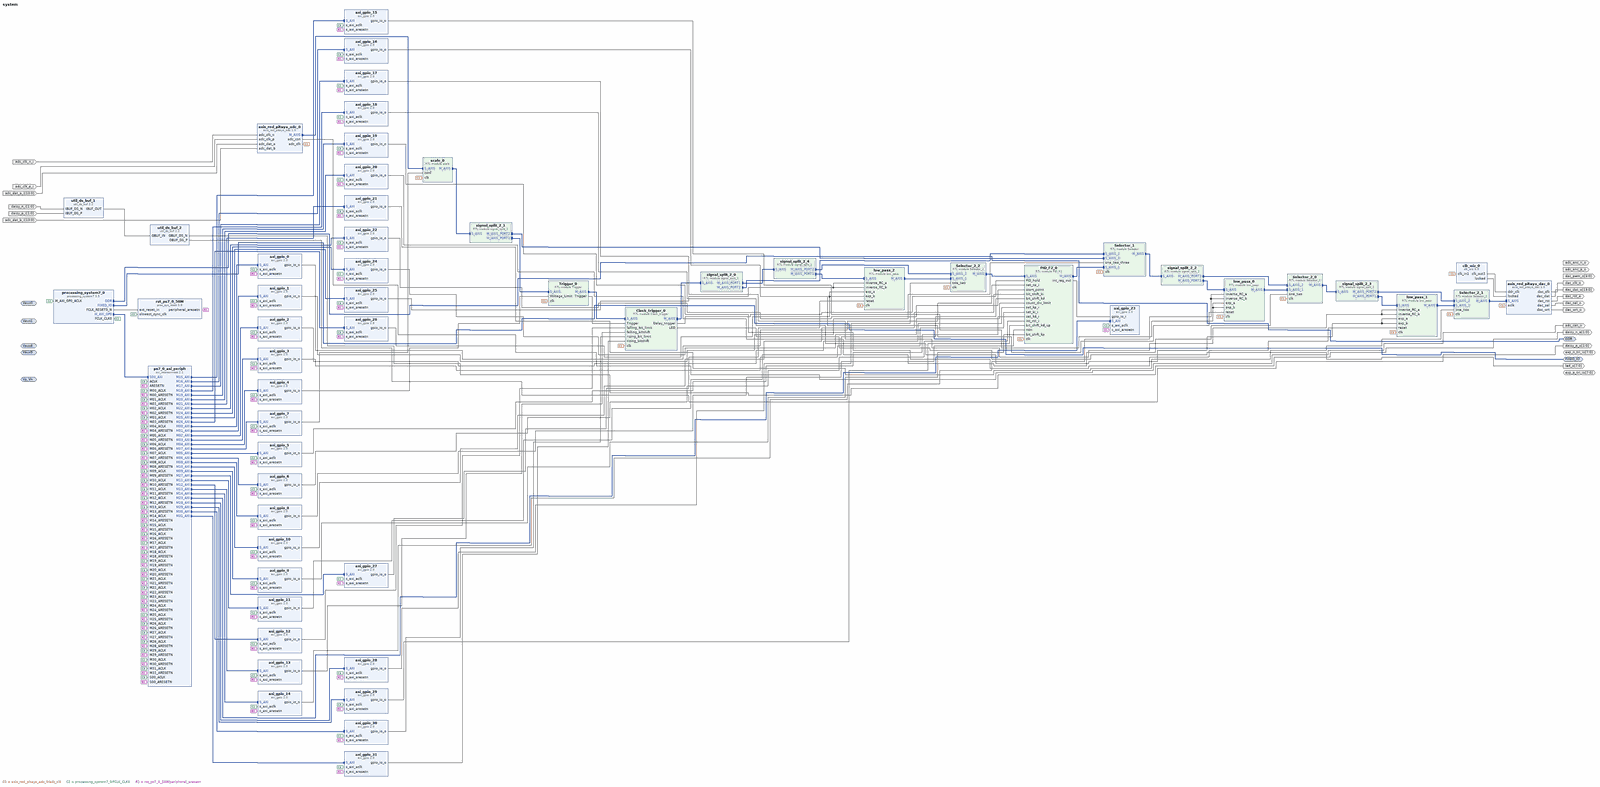
[diagram p0: block diagram of the top level, whole]
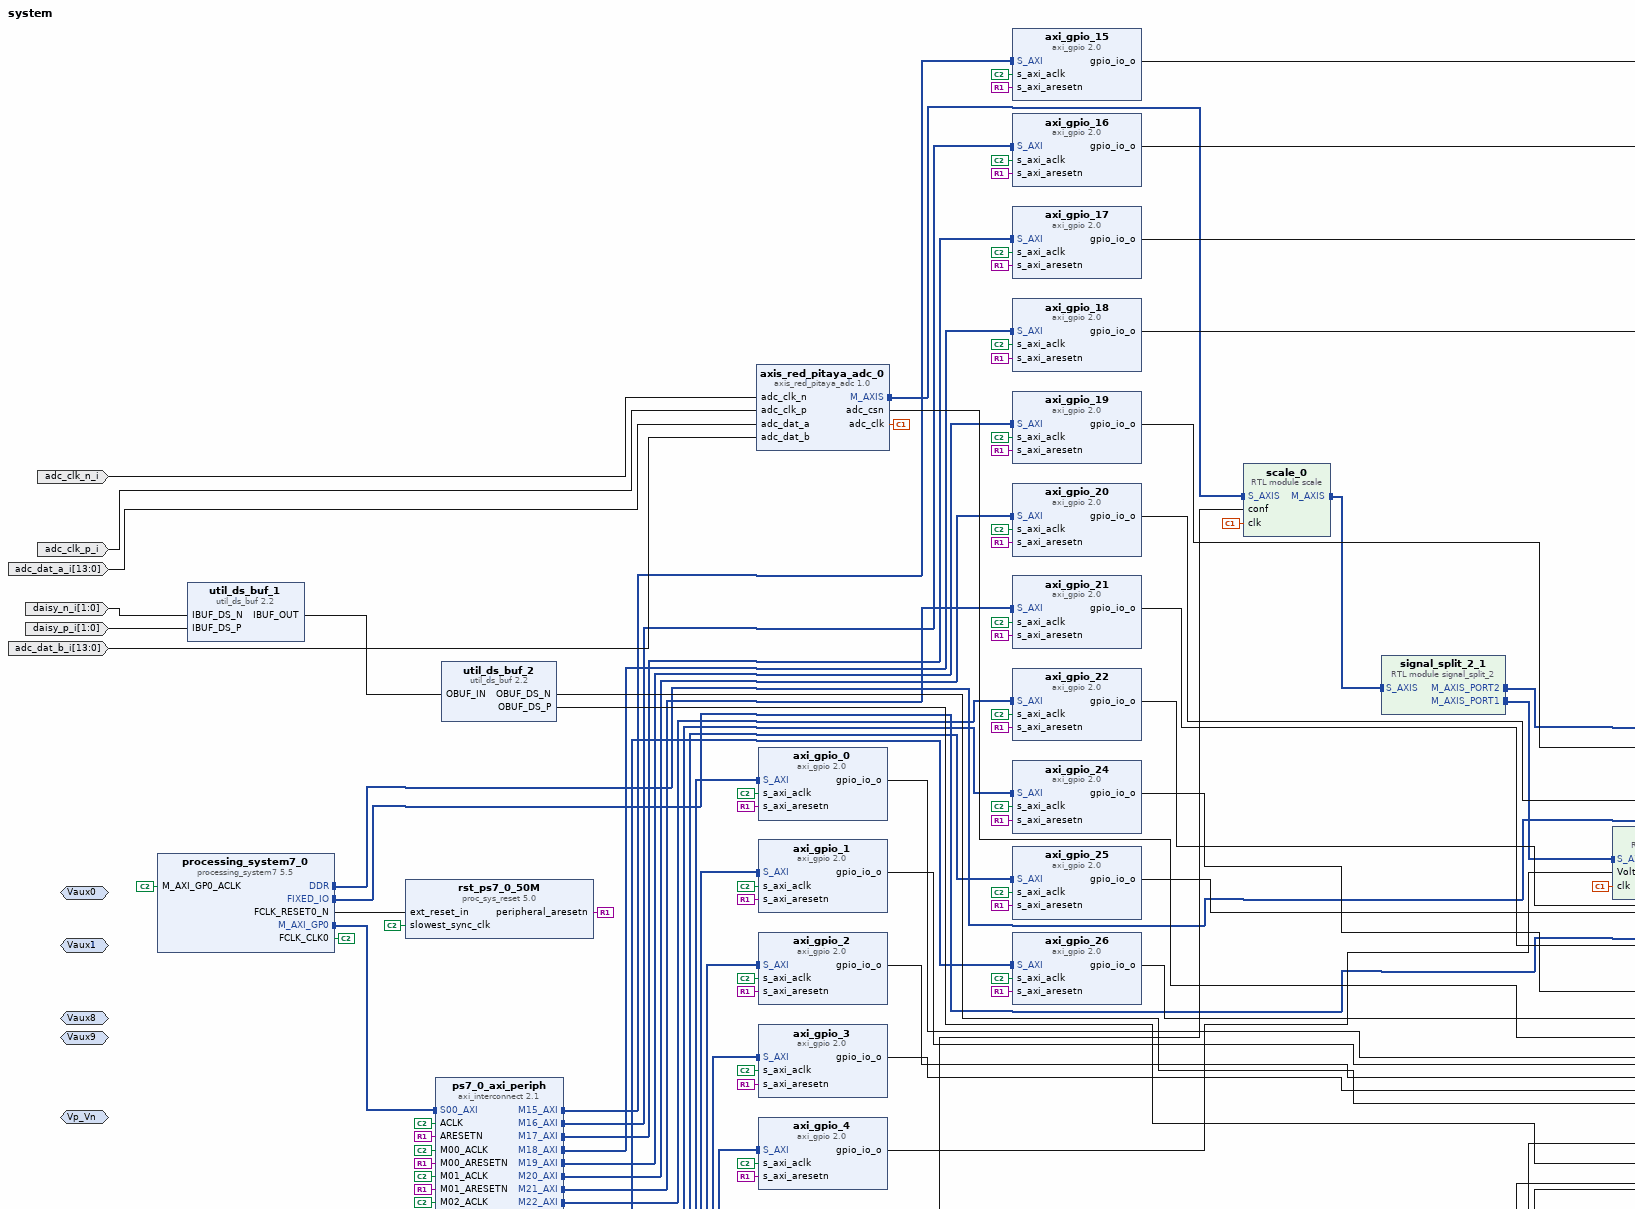
[diagram p1: block diagram of the top level, upper left part]
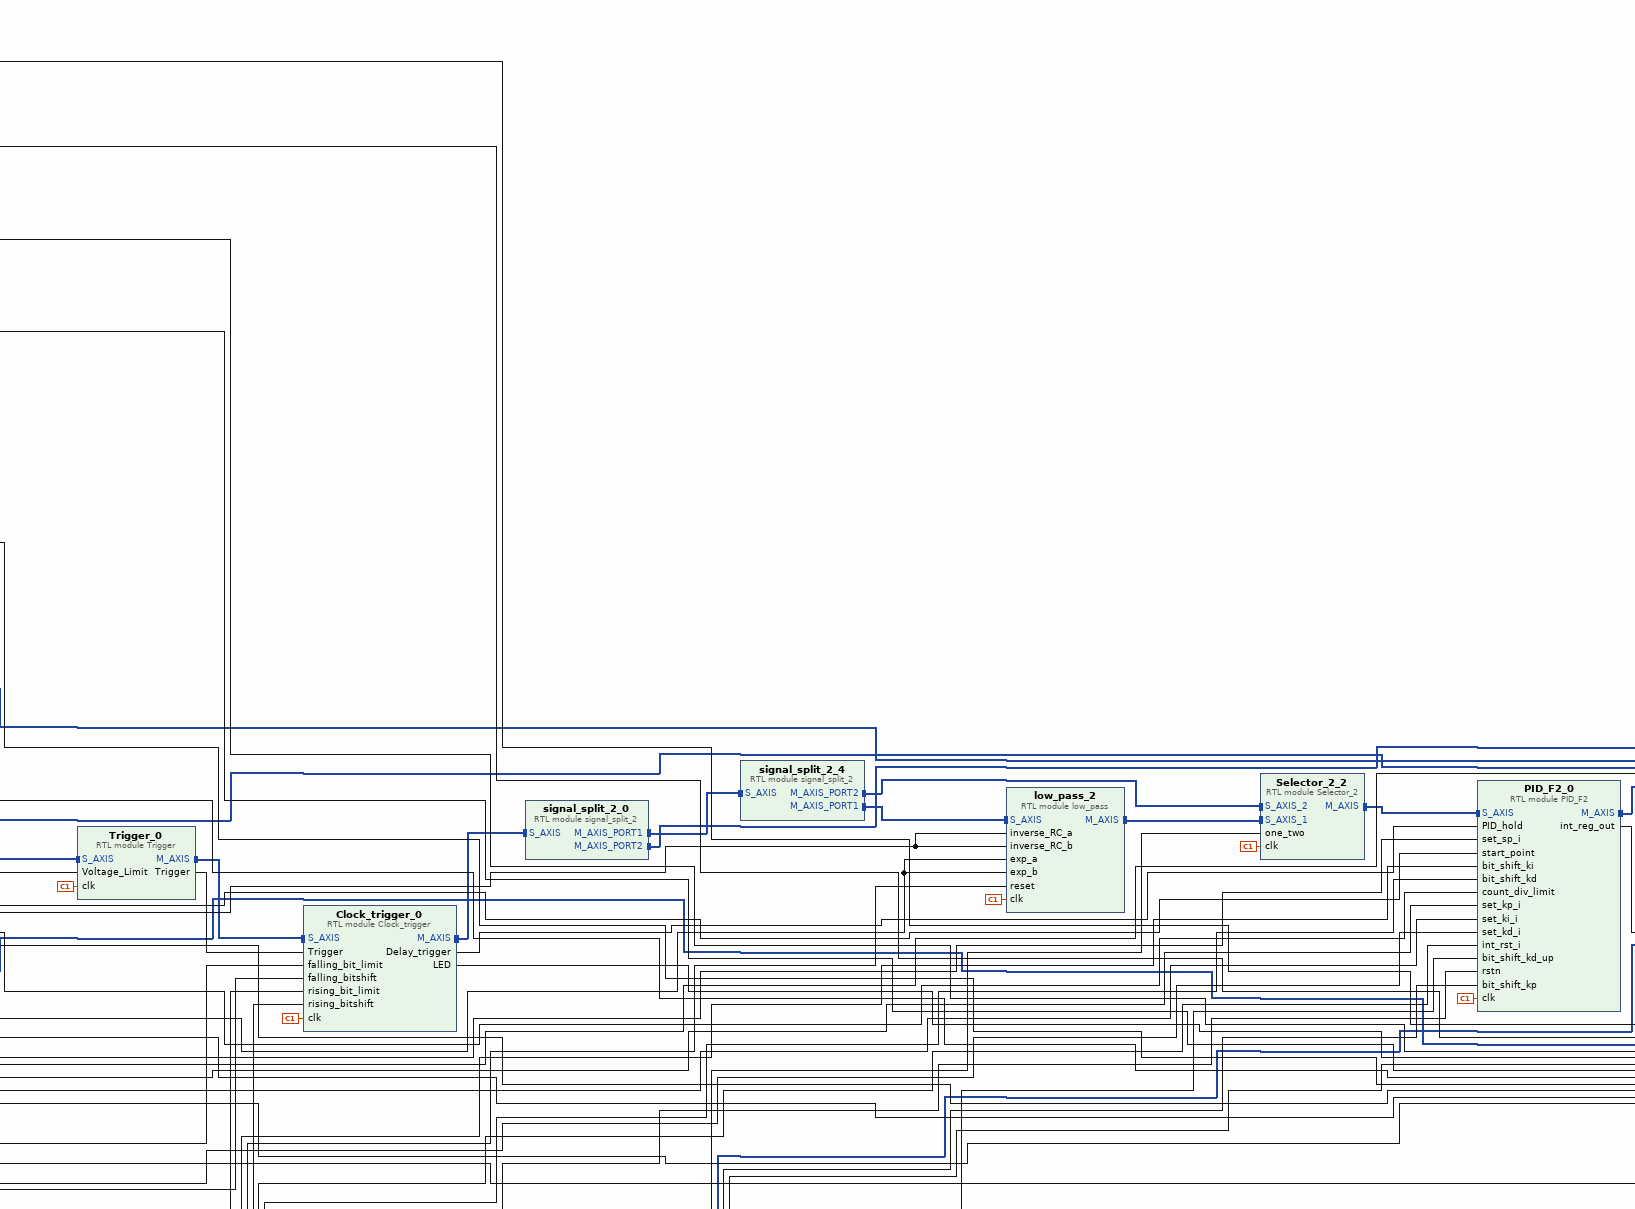
[diagram p2: block diagram of the top level, upper centre part]
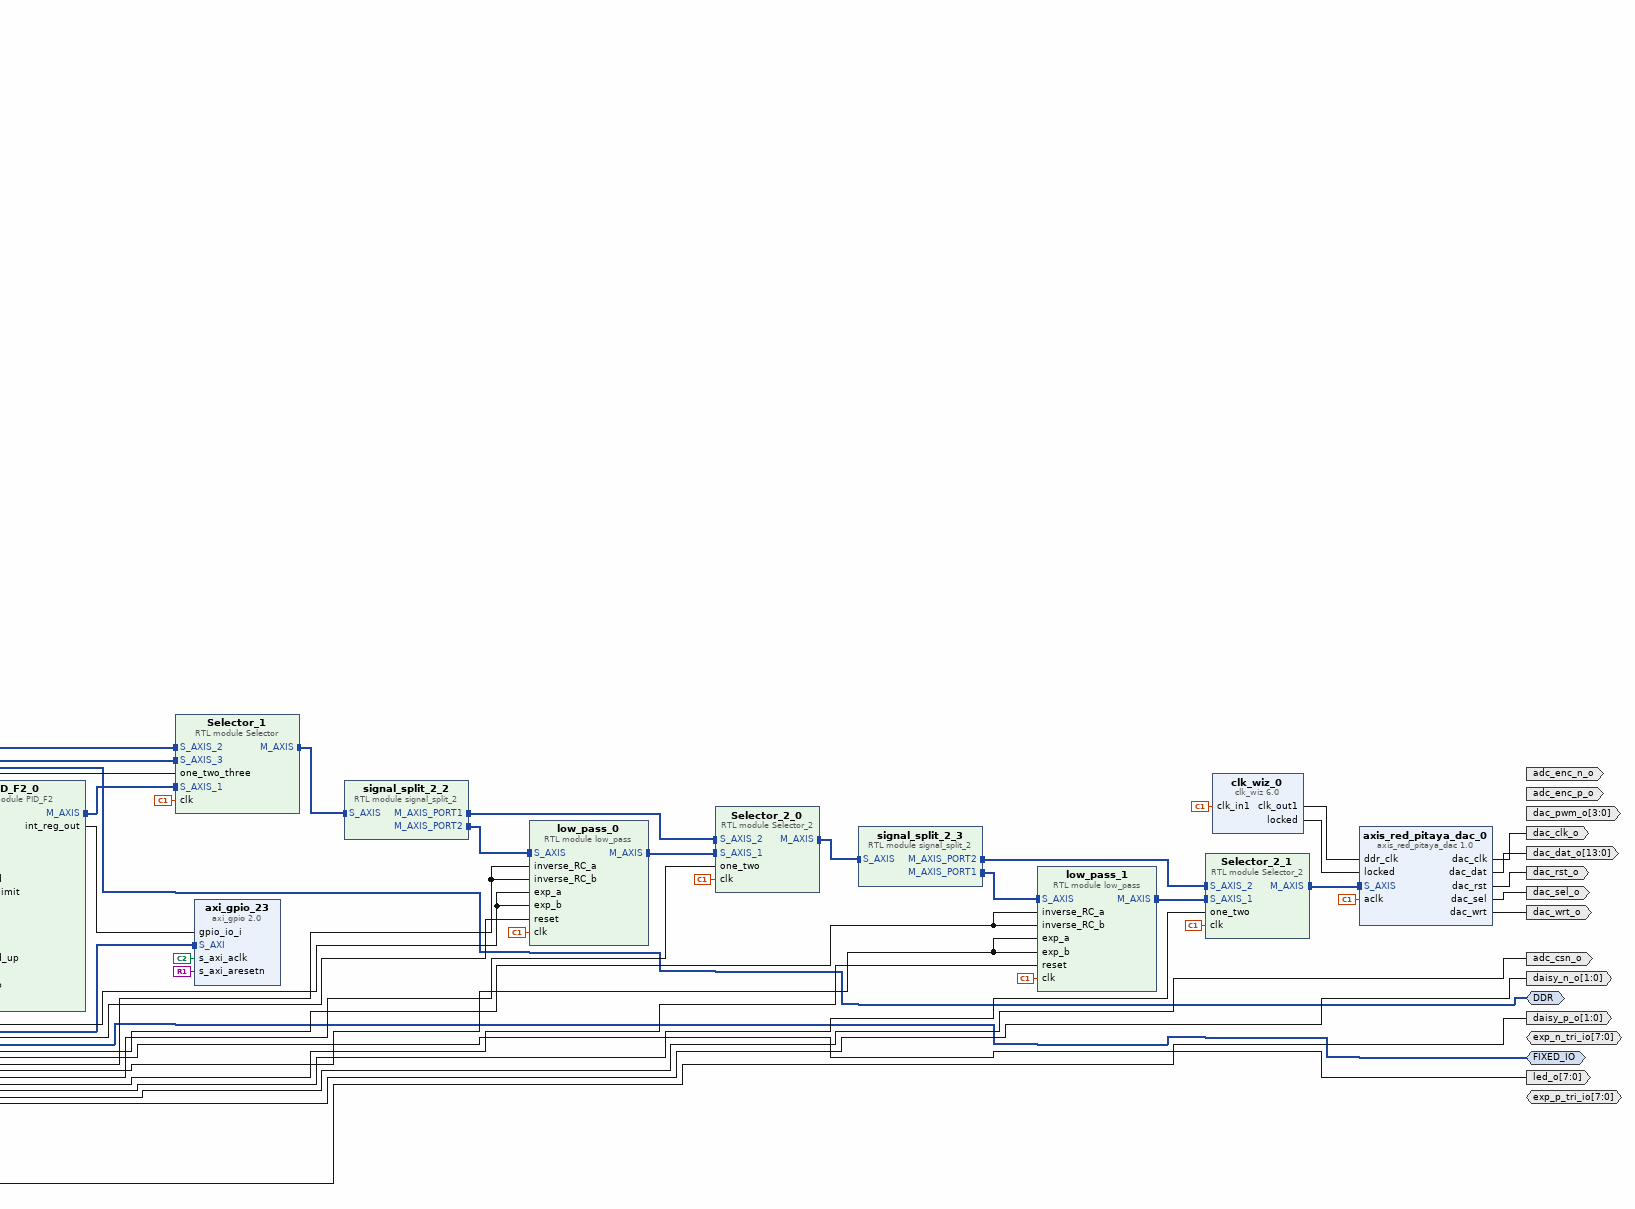
[diagram p3: block diagram of the top level, upper right part]
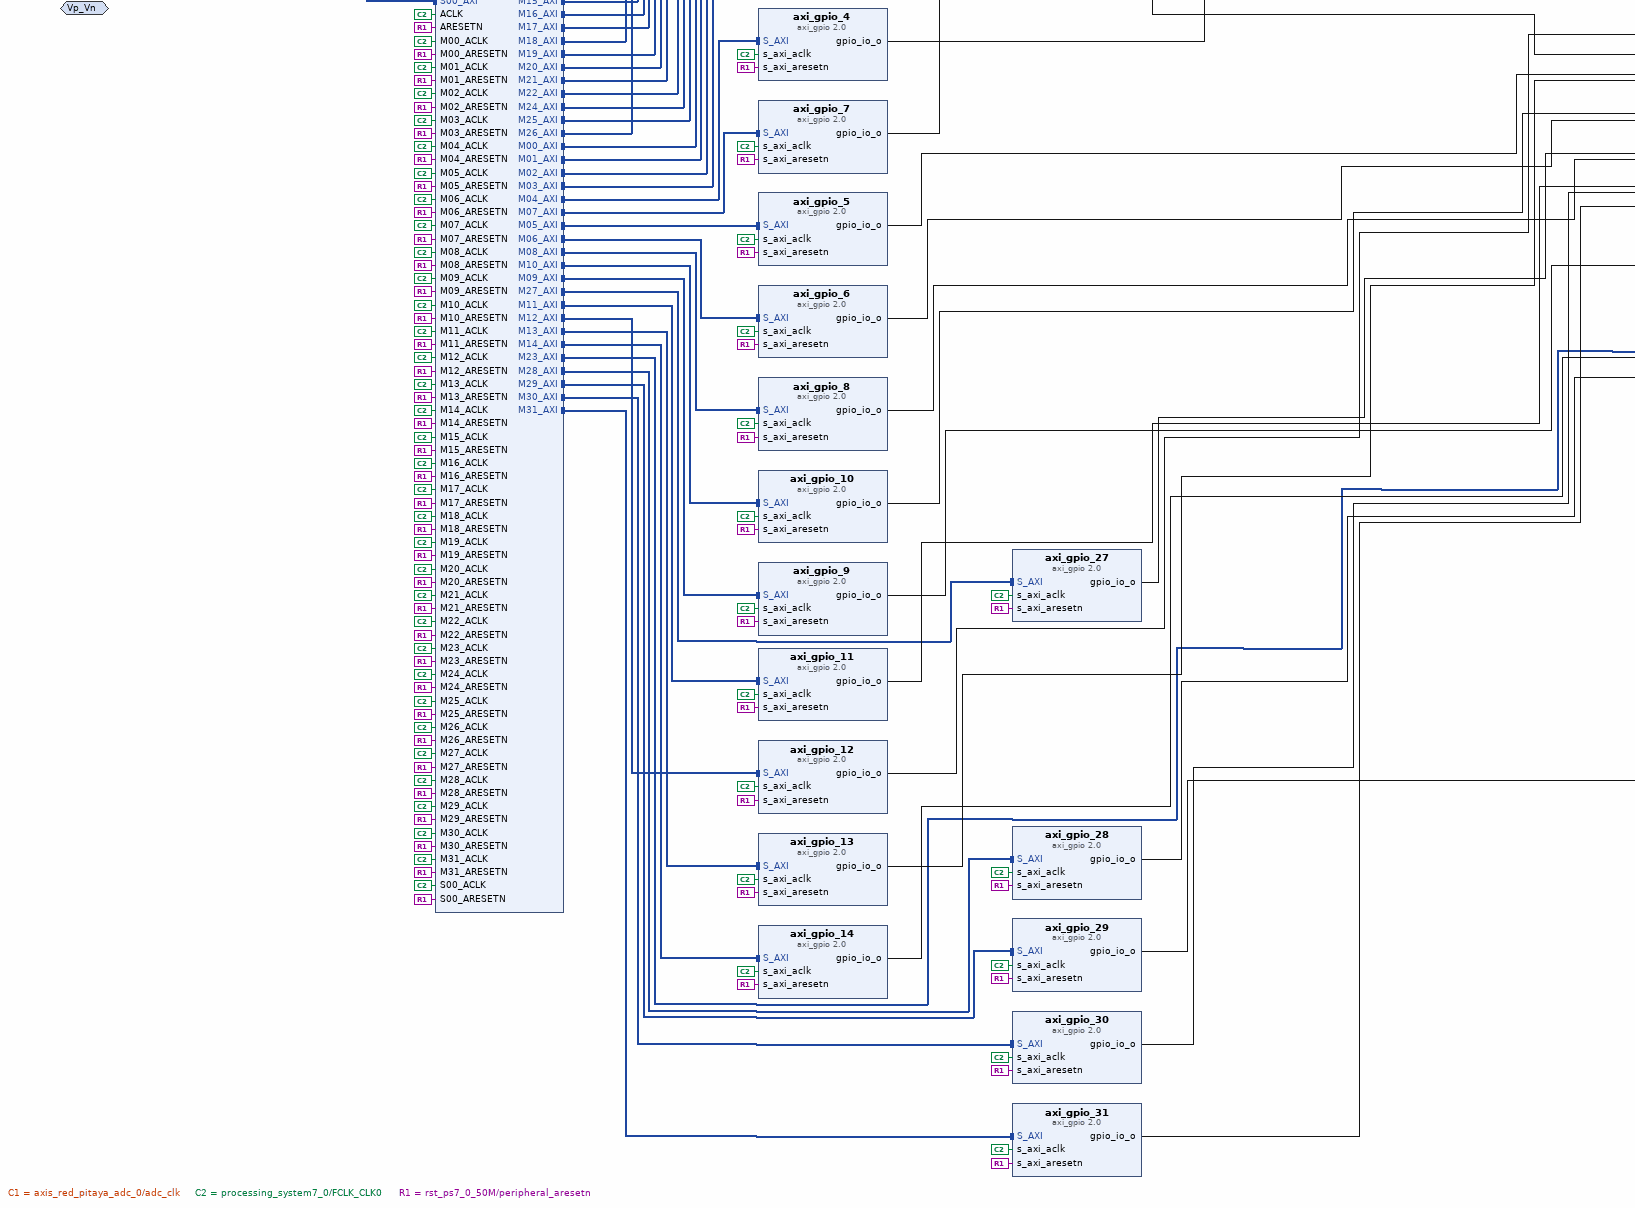
[diagram p4: block diagram of the top level, lower left part]
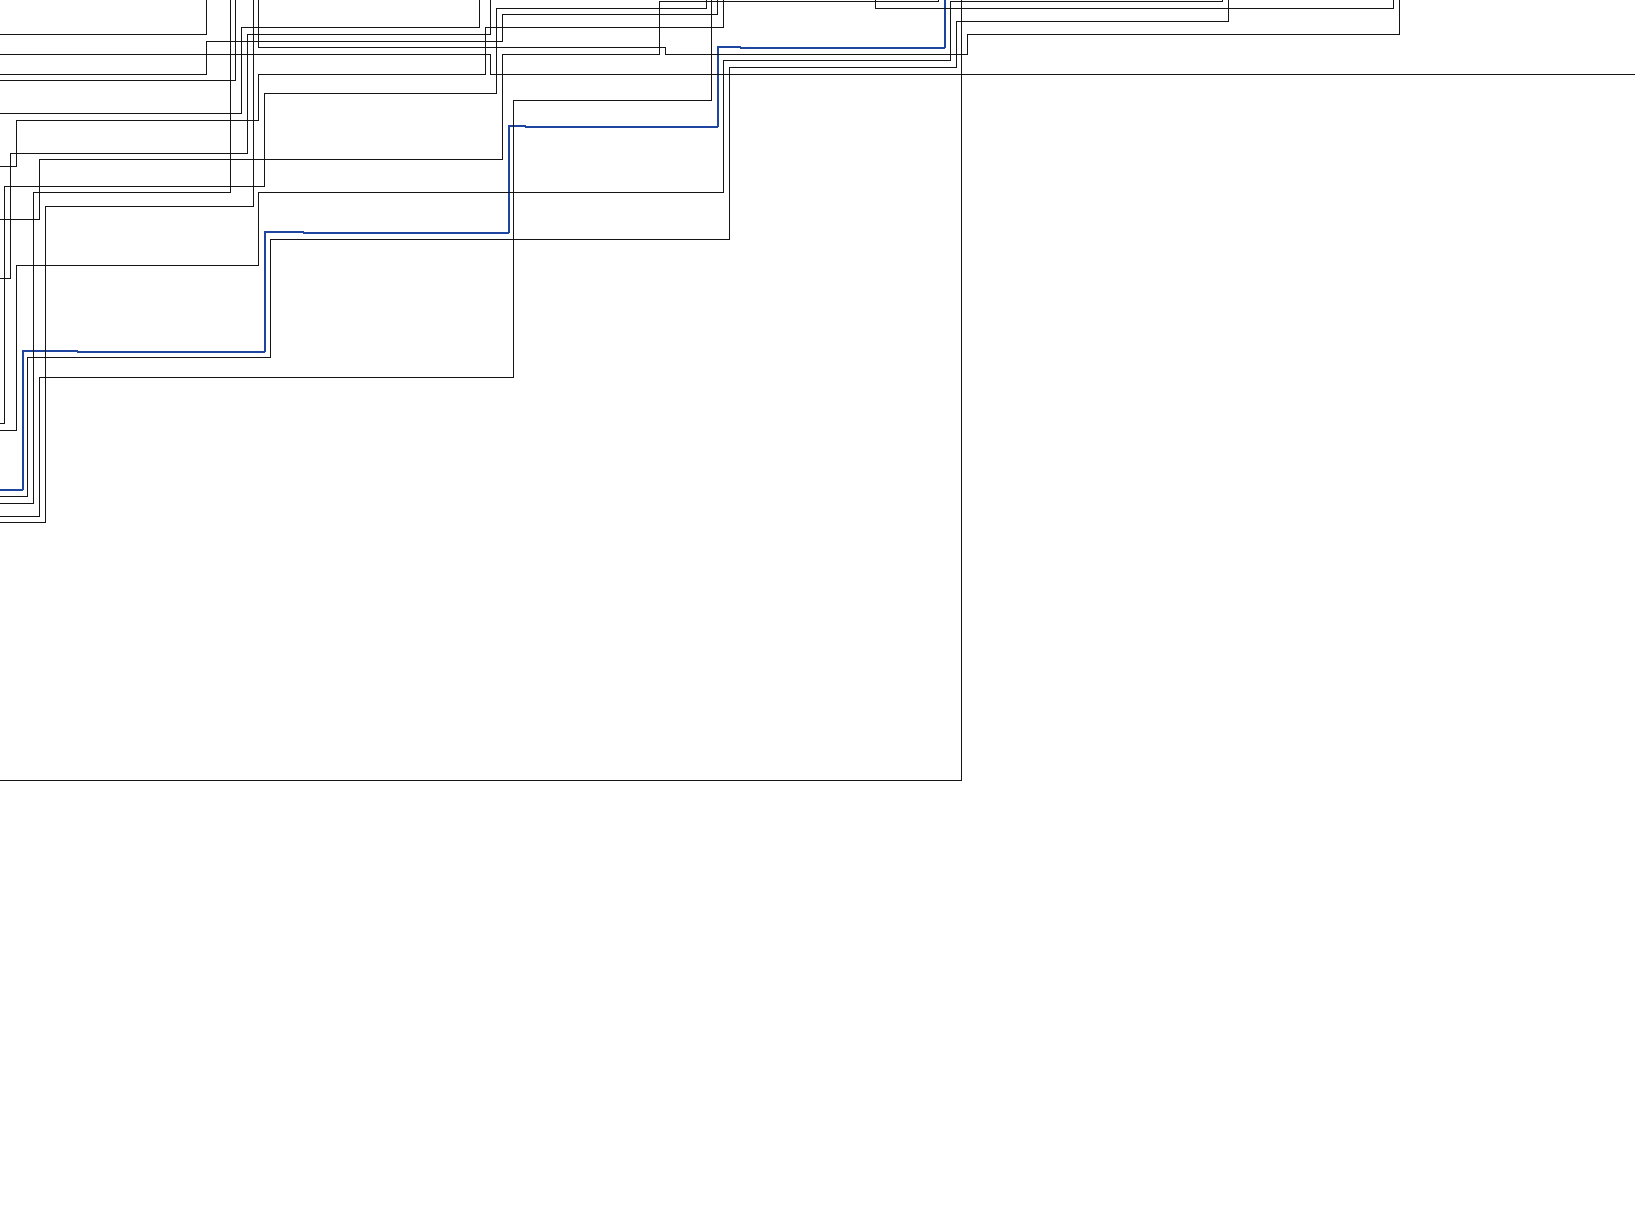
[diagram p5: block diagram of the top level, lower centre part]
# Vivado block design system, xc7z010clg400-1, Vivado 2023.2
create_bd_design system

create_bd_intf_port -mode Slave -vlnv xilinx.com:interface:diff_analog_io_rtl:1.0 Vp_Vn
create_bd_intf_port -mode Slave -vlnv xilinx.com:interface:diff_analog_io_rtl:1.0 Vaux0
create_bd_intf_port -mode Slave -vlnv xilinx.com:interface:diff_analog_io_rtl:1.0 Vaux1
create_bd_intf_port -mode Slave -vlnv xilinx.com:interface:diff_analog_io_rtl:1.0 Vaux9
create_bd_intf_port -mode Slave -vlnv xilinx.com:interface:diff_analog_io_rtl:1.0 Vaux8
create_bd_intf_port -mode Master -vlnv xilinx.com:interface:ddrx_rtl:1.0 DDR
create_bd_intf_port -mode Master -vlnv xilinx.com:display_processing_system7:fixedio_rtl:1.0 FIXED_IO
create_bd_port -dir I -from 13 -to 0 adc_dat_a_i
create_bd_port -dir I -from 13 -to 0 adc_dat_b_i
create_bd_port -dir I adc_clk_p_i
create_bd_port -dir I adc_clk_n_i
create_bd_port -dir O adc_enc_p_o
create_bd_port -dir O adc_enc_n_o
create_bd_port -dir O adc_csn_o
create_bd_port -dir O -from 13 -to 0 dac_dat_o
create_bd_port -dir O dac_clk_o
create_bd_port -dir O dac_rst_o
create_bd_port -dir O dac_sel_o
create_bd_port -dir O dac_wrt_o
create_bd_port -dir O -from 3 -to 0 dac_pwm_o
create_bd_port -dir IO -from 7 -to 0 exp_p_tri_io
create_bd_port -dir IO -from 7 -to 0 exp_n_tri_io
create_bd_port -dir O -from 1 -to 0 daisy_p_o
create_bd_port -dir O -from 1 -to 0 daisy_n_o
create_bd_port -dir I -from 1 -to 0 daisy_p_i
create_bd_port -dir I -from 1 -to 0 daisy_n_i
create_bd_port -dir O -from 7 -to 0 led_o

create_bd_cell -type ip -vlnv xilinx.com:ip:util_ds_buf:2.2 util_ds_buf_1
set_property -dict {CONFIG.C_SIZE 2} [get_bd_cells util_ds_buf_1]
create_bd_cell -type ip -vlnv xilinx.com:ip:util_ds_buf:2.2 util_ds_buf_2
set_property -dict {CONFIG.C_BUF_TYPE OBUFDS CONFIG.C_SIZE 2} [get_bd_cells util_ds_buf_2]
create_bd_cell -type ip -vlnv pavel-demin:user:axis_red_pitaya_adc:1.0 axis_red_pitaya_adc_0
create_bd_cell -type ip -vlnv pavel-demin:user:axis_red_pitaya_dac:1.0 axis_red_pitaya_dac_0
create_bd_cell -type ip -vlnv xilinx.com:ip:clk_wiz:6.0 clk_wiz_0
set_property -dict [list \
  CONFIG.CLKIN1_JITTER_PS 80.0 \
  CONFIG.CLKOUT1_JITTER 104.759 \
  CONFIG.CLKOUT1_PHASE_ERROR 96.948 \
  CONFIG.CLKOUT1_REQUESTED_OUT_FREQ 250 \
  CONFIG.MMCM_CLKFBOUT_MULT_F 8.000 \
  CONFIG.MMCM_CLKIN1_PERIOD 8.000 \
  CONFIG.MMCM_CLKOUT0_DIVIDE_F 4.000 \
  CONFIG.PRIM_IN_FREQ 125 \
  CONFIG.USE_RESET false \
] [get_bd_cells clk_wiz_0]
create_bd_cell -type module -reference signal_split_2 signal_split_2_0
create_bd_cell -type ip -vlnv xilinx.com:ip:axi_gpio:2.0 axi_gpio_1
set_property -dict {CONFIG.C_ALL_OUTPUTS 1 CONFIG.C_GPIO_WIDTH 2} [get_bd_cells axi_gpio_1]
create_bd_cell -type module -reference Trigger Trigger_0
create_bd_cell -type ip -vlnv xilinx.com:ip:axi_gpio:2.0 axi_gpio_4
set_property -dict {CONFIG.C_ALL_INPUTS 0 CONFIG.C_ALL_OUTPUTS 1 CONFIG.C_GPIO_WIDTH 14} [get_bd_cells axi_gpio_4]
create_bd_cell -type module -reference scale scale_0
create_bd_cell -type ip -vlnv xilinx.com:ip:axi_gpio:2.0 axi_gpio_7
set_property -dict {CONFIG.C_ALL_OUTPUTS 1 CONFIG.C_GPIO_WIDTH 18} [get_bd_cells axi_gpio_7]
create_bd_cell -type module -reference Selector Selector_1
create_bd_cell -type module -reference signal_split_2 signal_split_2_1
create_bd_cell -type ip -vlnv xilinx.com:ip:axi_gpio:2.0 axi_gpio_0
set_property -dict {CONFIG.C_ALL_OUTPUTS 1 CONFIG.C_GPIO_WIDTH 14} [get_bd_cells axi_gpio_0]
create_bd_cell -type ip -vlnv xilinx.com:ip:axi_gpio:2.0 axi_gpio_2
set_property -dict {CONFIG.C_ALL_OUTPUTS 1 CONFIG.C_GPIO_WIDTH 14} [get_bd_cells axi_gpio_2]
create_bd_cell -type ip -vlnv xilinx.com:ip:axi_gpio:2.0 axi_gpio_3
set_property -dict {CONFIG.C_ALL_OUTPUTS 1 CONFIG.C_GPIO_WIDTH 14} [get_bd_cells axi_gpio_3]
create_bd_cell -type ip -vlnv xilinx.com:ip:axi_gpio:2.0 axi_gpio_5
set_property -dict {CONFIG.C_ALL_OUTPUTS 1 CONFIG.C_GPIO_WIDTH 29} [get_bd_cells axi_gpio_5]
create_bd_cell -type ip -vlnv xilinx.com:ip:axi_gpio:2.0 axi_gpio_6
set_property -dict {CONFIG.C_ALL_OUTPUTS 1 CONFIG.C_GPIO_WIDTH 1} [get_bd_cells axi_gpio_6]
create_bd_cell -type ip -vlnv xilinx.com:ip:axi_gpio:2.0 axi_gpio_8
set_property -dict {CONFIG.C_ALL_OUTPUTS 1 CONFIG.C_GPIO_WIDTH 1} [get_bd_cells axi_gpio_8]
create_bd_cell -type ip -vlnv xilinx.com:ip:processing_system7:5.5 processing_system7_0
# 1 more settings of processing_system7_0 are not shown: defaults, MIO pin electricals, DDR timing, and values the tool derives
create_bd_cell -type ip -vlnv xilinx.com:ip:axi_gpio:2.0 axi_gpio_9
set_property -dict {CONFIG.C_ALL_INPUTS 0 CONFIG.C_ALL_OUTPUTS 1 CONFIG.C_GPIO_WIDTH 14} [get_bd_cells axi_gpio_9]
create_bd_cell -type ip -vlnv xilinx.com:ip:axi_gpio:2.0 axi_gpio_10
set_property -dict {CONFIG.C_ALL_INPUTS 0 CONFIG.C_ALL_OUTPUTS 1 CONFIG.C_GPIO_WIDTH 14} [get_bd_cells axi_gpio_10]
create_bd_cell -type ip -vlnv xilinx.com:ip:axi_gpio:2.0 axi_gpio_11
set_property -dict {CONFIG.C_ALL_INPUTS 0 CONFIG.C_ALL_OUTPUTS 1 CONFIG.C_GPIO_WIDTH 14} [get_bd_cells axi_gpio_11]
create_bd_cell -type ip -vlnv xilinx.com:ip:proc_sys_reset:5.0 rst_ps7_0_50M
create_bd_cell -type ip -vlnv xilinx.com:ip:axi_gpio:2.0 axi_gpio_12
set_property -dict {CONFIG.C_ALL_OUTPUTS 1 CONFIG.C_GPIO_WIDTH 32} [get_bd_cells axi_gpio_12]
create_bd_cell -type ip -vlnv xilinx.com:ip:axi_gpio:2.0 axi_gpio_13
set_property -dict {CONFIG.C_ALL_OUTPUTS 1 CONFIG.C_GPIO_WIDTH 32} [get_bd_cells axi_gpio_13]
create_bd_cell -type module -reference low_pass low_pass_0
create_bd_cell -type module -reference low_pass low_pass_1
create_bd_cell -type module -reference Selector_2 Selector_2_0
create_bd_cell -type module -reference signal_split_2 signal_split_2_2
create_bd_cell -type module -reference signal_split_2 signal_split_2_3
create_bd_cell -type module -reference Selector_2 Selector_2_1
create_bd_cell -type ip -vlnv xilinx.com:ip:axi_gpio:2.0 axi_gpio_14
set_property -dict {CONFIG.C_ALL_OUTPUTS 1 CONFIG.C_GPIO_WIDTH 14} [get_bd_cells axi_gpio_14]
create_bd_cell -type ip -vlnv xilinx.com:ip:axi_gpio:2.0 axi_gpio_15
set_property -dict {CONFIG.C_ALL_OUTPUTS 1 CONFIG.C_GPIO_WIDTH 14} [get_bd_cells axi_gpio_15]
create_bd_cell -type ip -vlnv xilinx.com:ip:axi_gpio:2.0 axi_gpio_16
set_property -dict {CONFIG.C_ALL_OUTPUTS 1 CONFIG.C_GPIO_WIDTH 1} [get_bd_cells axi_gpio_16]
create_bd_cell -type ip -vlnv xilinx.com:ip:axi_gpio:2.0 axi_gpio_17
set_property -dict {CONFIG.C_ALL_OUTPUTS 1 CONFIG.C_GPIO_WIDTH 14} [get_bd_cells axi_gpio_17]
create_bd_cell -type ip -vlnv xilinx.com:ip:axi_gpio:2.0 axi_gpio_18
set_property -dict {CONFIG.C_ALL_OUTPUTS 1 CONFIG.C_GPIO_WIDTH 14} [get_bd_cells axi_gpio_18]
create_bd_cell -type ip -vlnv xilinx.com:ip:axi_gpio:2.0 axi_gpio_19
set_property -dict {CONFIG.C_ALL_OUTPUTS 1 CONFIG.C_GPIO_WIDTH 1} [get_bd_cells axi_gpio_19]
create_bd_cell -type ip -vlnv xilinx.com:ip:axi_gpio:2.0 axi_gpio_20
set_property -dict {CONFIG.C_ALL_OUTPUTS 1 CONFIG.C_GPIO_WIDTH 1} [get_bd_cells axi_gpio_20]
create_bd_cell -type ip -vlnv xilinx.com:ip:axi_gpio:2.0 axi_gpio_21
set_property -dict {CONFIG.C_ALL_OUTPUTS 1 CONFIG.C_GPIO_WIDTH 1} [get_bd_cells axi_gpio_21]
create_bd_cell -type ip -vlnv xilinx.com:ip:axi_gpio:2.0 axi_gpio_22
set_property -dict {CONFIG.C_ALL_OUTPUTS 1 CONFIG.C_GPIO_WIDTH 14} [get_bd_cells axi_gpio_22]
create_bd_cell -type ip -vlnv xilinx.com:ip:axi_gpio:2.0 axi_gpio_23
set_property -dict {CONFIG.C_ALL_INPUTS 1 CONFIG.C_GPIO_WIDTH 32} [get_bd_cells axi_gpio_23]
create_bd_cell -type module -reference PID_F2 PID_F2_0
create_bd_cell -type ip -vlnv xilinx.com:ip:axi_gpio:2.0 axi_gpio_24
set_property -dict {CONFIG.C_ALL_OUTPUTS 1} [get_bd_cells axi_gpio_24]
create_bd_cell -type module -reference low_pass low_pass_2
create_bd_cell -type ip -vlnv xilinx.com:ip:axi_gpio:2.0 axi_gpio_25
set_property -dict {CONFIG.C_ALL_OUTPUTS 1 CONFIG.C_GPIO_WIDTH 14} [get_bd_cells axi_gpio_25]
create_bd_cell -type ip -vlnv xilinx.com:ip:axi_gpio:2.0 axi_gpio_26
set_property -dict {CONFIG.C_ALL_OUTPUTS 1 CONFIG.C_GPIO_WIDTH 14} [get_bd_cells axi_gpio_26]
create_bd_cell -type ip -vlnv xilinx.com:ip:axi_gpio:2.0 axi_gpio_27
set_property -dict {CONFIG.C_ALL_OUTPUTS 1 CONFIG.C_GPIO_WIDTH 1} [get_bd_cells axi_gpio_27]
create_bd_cell -type module -reference signal_split_2 signal_split_2_4
create_bd_cell -type module -reference Selector_2 Selector_2_2
create_bd_cell -type ip -vlnv xilinx.com:ip:axi_gpio:2.0 axi_gpio_28
set_property -dict {CONFIG.C_ALL_OUTPUTS 1 CONFIG.C_GPIO_WIDTH 1} [get_bd_cells axi_gpio_28]
create_bd_cell -type ip -vlnv xilinx.com:ip:axi_gpio:2.0 axi_gpio_29
set_property -dict {CONFIG.C_ALL_OUTPUTS 1 CONFIG.C_GPIO_WIDTH 14} [get_bd_cells axi_gpio_29]
create_bd_cell -type ip -vlnv xilinx.com:ip:axi_gpio:2.0 axi_gpio_30
set_property -dict {CONFIG.C_ALL_OUTPUTS 1} [get_bd_cells axi_gpio_30]
create_bd_cell -type ip -vlnv xilinx.com:ip:axi_gpio:2.0 axi_gpio_31
set_property -dict {CONFIG.C_ALL_OUTPUTS 1} [get_bd_cells axi_gpio_31]
create_bd_cell -type module -reference Clock_trigger Clock_trigger_0
create_bd_cell -type ip -vlnv xilinx.com:ip:axi_interconnect:2.1 ps7_0_axi_periph
set_property -dict {CONFIG.NUM_MI 32} [get_bd_cells ps7_0_axi_periph]

# ---- connections ----

connect_bd_intf_net [get_bd_intf_pins Clock_trigger_0/M_AXIS] [get_bd_intf_pins signal_split_2_0/S_AXIS]
connect_bd_intf_net [get_bd_intf_pins PID_F2_0/M_AXIS] [get_bd_intf_pins Selector_1/S_AXIS_1]
connect_bd_intf_net [get_bd_intf_pins Selector_1/M_AXIS] [get_bd_intf_pins signal_split_2_2/S_AXIS]
connect_bd_intf_net [get_bd_intf_pins Selector_2_0/M_AXIS] [get_bd_intf_pins signal_split_2_3/S_AXIS]
connect_bd_intf_net [get_bd_intf_pins Selector_2_1/M_AXIS] [get_bd_intf_pins axis_red_pitaya_dac_0/S_AXIS]
connect_bd_intf_net [get_bd_intf_pins PID_F2_0/S_AXIS] [get_bd_intf_pins Selector_2_2/M_AXIS]
connect_bd_intf_net [get_bd_intf_pins Trigger_0/M_AXIS] [get_bd_intf_pins Clock_trigger_0/S_AXIS]
connect_bd_intf_net [get_bd_intf_pins axis_red_pitaya_adc_0/M_AXIS] [get_bd_intf_pins scale_0/S_AXIS]
connect_bd_intf_net [get_bd_intf_pins low_pass_0/M_AXIS] [get_bd_intf_pins Selector_2_0/S_AXIS_1]
connect_bd_intf_net [get_bd_intf_pins low_pass_1/M_AXIS] [get_bd_intf_pins Selector_2_1/S_AXIS_1]
connect_bd_intf_net [get_bd_intf_pins low_pass_2/M_AXIS] [get_bd_intf_pins Selector_2_2/S_AXIS_1]
connect_bd_intf_net [get_bd_intf_ports DDR] [get_bd_intf_pins processing_system7_0/DDR]
connect_bd_intf_net [get_bd_intf_ports FIXED_IO] [get_bd_intf_pins processing_system7_0/FIXED_IO]
connect_bd_intf_net [get_bd_intf_pins processing_system7_0/M_AXI_GP0] [get_bd_intf_pins ps7_0_axi_periph/S00_AXI]
connect_bd_intf_net [get_bd_intf_pins ps7_0_axi_periph/M00_AXI] [get_bd_intf_pins axi_gpio_0/S_AXI]
connect_bd_intf_net [get_bd_intf_pins ps7_0_axi_periph/M01_AXI] [get_bd_intf_pins axi_gpio_1/S_AXI]
connect_bd_intf_net [get_bd_intf_pins ps7_0_axi_periph/M02_AXI] [get_bd_intf_pins axi_gpio_2/S_AXI]
connect_bd_intf_net [get_bd_intf_pins ps7_0_axi_periph/M03_AXI] [get_bd_intf_pins axi_gpio_3/S_AXI]
connect_bd_intf_net [get_bd_intf_pins ps7_0_axi_periph/M04_AXI] [get_bd_intf_pins axi_gpio_4/S_AXI]
connect_bd_intf_net [get_bd_intf_pins ps7_0_axi_periph/M05_AXI] [get_bd_intf_pins axi_gpio_5/S_AXI]
connect_bd_intf_net [get_bd_intf_pins ps7_0_axi_periph/M06_AXI] [get_bd_intf_pins axi_gpio_6/S_AXI]
connect_bd_intf_net [get_bd_intf_pins ps7_0_axi_periph/M07_AXI] [get_bd_intf_pins axi_gpio_7/S_AXI]
connect_bd_intf_net [get_bd_intf_pins ps7_0_axi_periph/M08_AXI] [get_bd_intf_pins axi_gpio_8/S_AXI]
connect_bd_intf_net [get_bd_intf_pins ps7_0_axi_periph/M09_AXI] [get_bd_intf_pins axi_gpio_9/S_AXI]
connect_bd_intf_net [get_bd_intf_pins ps7_0_axi_periph/M10_AXI] [get_bd_intf_pins axi_gpio_10/S_AXI]
connect_bd_intf_net [get_bd_intf_pins ps7_0_axi_periph/M11_AXI] [get_bd_intf_pins axi_gpio_11/S_AXI]
connect_bd_intf_net [get_bd_intf_pins ps7_0_axi_periph/M12_AXI] [get_bd_intf_pins axi_gpio_12/S_AXI]
connect_bd_intf_net [get_bd_intf_pins ps7_0_axi_periph/M13_AXI] [get_bd_intf_pins axi_gpio_13/S_AXI]
connect_bd_intf_net [get_bd_intf_pins ps7_0_axi_periph/M14_AXI] [get_bd_intf_pins axi_gpio_14/S_AXI]
connect_bd_intf_net [get_bd_intf_pins ps7_0_axi_periph/M15_AXI] [get_bd_intf_pins axi_gpio_15/S_AXI]
connect_bd_intf_net [get_bd_intf_pins ps7_0_axi_periph/M16_AXI] [get_bd_intf_pins axi_gpio_16/S_AXI]
connect_bd_intf_net [get_bd_intf_pins ps7_0_axi_periph/M17_AXI] [get_bd_intf_pins axi_gpio_17/S_AXI]
connect_bd_intf_net [get_bd_intf_pins ps7_0_axi_periph/M18_AXI] [get_bd_intf_pins axi_gpio_18/S_AXI]
connect_bd_intf_net [get_bd_intf_pins ps7_0_axi_periph/M19_AXI] [get_bd_intf_pins axi_gpio_19/S_AXI]
connect_bd_intf_net [get_bd_intf_pins ps7_0_axi_periph/M20_AXI] [get_bd_intf_pins axi_gpio_20/S_AXI]
connect_bd_intf_net [get_bd_intf_pins ps7_0_axi_periph/M21_AXI] [get_bd_intf_pins axi_gpio_21/S_AXI]
connect_bd_intf_net [get_bd_intf_pins ps7_0_axi_periph/M22_AXI] [get_bd_intf_pins axi_gpio_22/S_AXI]
connect_bd_intf_net [get_bd_intf_pins ps7_0_axi_periph/M23_AXI] [get_bd_intf_pins axi_gpio_23/S_AXI]
connect_bd_intf_net [get_bd_intf_pins ps7_0_axi_periph/M24_AXI] [get_bd_intf_pins axi_gpio_24/S_AXI]
connect_bd_intf_net [get_bd_intf_pins ps7_0_axi_periph/M25_AXI] [get_bd_intf_pins axi_gpio_25/S_AXI]
connect_bd_intf_net [get_bd_intf_pins ps7_0_axi_periph/M26_AXI] [get_bd_intf_pins axi_gpio_26/S_AXI]
connect_bd_intf_net [get_bd_intf_pins ps7_0_axi_periph/M27_AXI] [get_bd_intf_pins axi_gpio_27/S_AXI]
connect_bd_intf_net [get_bd_intf_pins ps7_0_axi_periph/M28_AXI] [get_bd_intf_pins axi_gpio_28/S_AXI]
connect_bd_intf_net [get_bd_intf_pins ps7_0_axi_periph/M29_AXI] [get_bd_intf_pins axi_gpio_29/S_AXI]
connect_bd_intf_net [get_bd_intf_pins ps7_0_axi_periph/M30_AXI] [get_bd_intf_pins axi_gpio_30/S_AXI]
connect_bd_intf_net [get_bd_intf_pins ps7_0_axi_periph/M31_AXI] [get_bd_intf_pins axi_gpio_31/S_AXI]
connect_bd_intf_net [get_bd_intf_pins signal_split_2_1/S_AXIS] [get_bd_intf_pins scale_0/M_AXIS]
connect_bd_intf_net [get_bd_intf_pins signal_split_2_0/M_AXIS_PORT1] [get_bd_intf_pins signal_split_2_4/S_AXIS]
connect_bd_intf_net [get_bd_intf_pins signal_split_2_0/M_AXIS_PORT2] [get_bd_intf_pins Selector_1/S_AXIS_2]
connect_bd_intf_net [get_bd_intf_pins signal_split_2_1/M_AXIS_PORT1] [get_bd_intf_pins Trigger_0/S_AXIS]
connect_bd_intf_net [get_bd_intf_pins signal_split_2_1/M_AXIS_PORT2] [get_bd_intf_pins Selector_1/S_AXIS_3]
connect_bd_intf_net [get_bd_intf_pins signal_split_2_2/M_AXIS_PORT1] [get_bd_intf_pins Selector_2_0/S_AXIS_2]
connect_bd_intf_net [get_bd_intf_pins signal_split_2_2/M_AXIS_PORT2] [get_bd_intf_pins low_pass_0/S_AXIS]
connect_bd_intf_net [get_bd_intf_pins signal_split_2_3/M_AXIS_PORT1] [get_bd_intf_pins low_pass_1/S_AXIS]
connect_bd_intf_net [get_bd_intf_pins signal_split_2_3/M_AXIS_PORT2] [get_bd_intf_pins Selector_2_1/S_AXIS_2]
connect_bd_intf_net [get_bd_intf_pins signal_split_2_4/M_AXIS_PORT1] [get_bd_intf_pins low_pass_2/S_AXIS]
connect_bd_intf_net [get_bd_intf_pins signal_split_2_4/M_AXIS_PORT2] [get_bd_intf_pins Selector_2_2/S_AXIS_2]
connect_bd_net [get_bd_pins Clock_trigger_0/Delay_trigger] [get_bd_pins PID_F2_0/PID_hold]
connect_bd_net [get_bd_pins Clock_trigger_0/LED] [get_bd_ports led_o]
connect_bd_net [get_bd_pins PID_F2_0/int_reg_out] [get_bd_pins axi_gpio_23/gpio_io_i]
connect_bd_net [get_bd_pins Trigger_0/Trigger] [get_bd_pins Clock_trigger_0/Trigger]
connect_bd_net [get_bd_ports adc_clk_n_i] [get_bd_pins axis_red_pitaya_adc_0/adc_clk_n]
connect_bd_net [get_bd_ports adc_clk_p_i] [get_bd_pins axis_red_pitaya_adc_0/adc_clk_p]
connect_bd_net [get_bd_ports adc_dat_a_i] [get_bd_pins axis_red_pitaya_adc_0/adc_dat_a]
connect_bd_net [get_bd_ports adc_dat_b_i] [get_bd_pins axis_red_pitaya_adc_0/adc_dat_b]
connect_bd_net [get_bd_pins axi_gpio_0/gpio_io_o] [get_bd_pins PID_F2_0/set_sp_i]
connect_bd_net [get_bd_pins axi_gpio_10/gpio_io_o] [get_bd_pins PID_F2_0/bit_shift_ki]
connect_bd_net [get_bd_pins axi_gpio_11/gpio_io_o] [get_bd_pins PID_F2_0/bit_shift_kd]
connect_bd_net [get_bd_pins axi_gpio_12/gpio_io_o] [get_bd_pins Clock_trigger_0/falling_bit_limit]
connect_bd_net [get_bd_pins axi_gpio_13/gpio_io_o] [get_bd_pins Clock_trigger_0/falling_bitshift]
connect_bd_net [get_bd_pins axi_gpio_14/gpio_io_o] [get_bd_pins low_pass_0/inverse_RC_a] [get_bd_pins low_pass_0/inverse_RC_b]
connect_bd_net [get_bd_pins axi_gpio_15/gpio_io_o] [get_bd_pins low_pass_0/exp_a] [get_bd_pins low_pass_0/exp_b]
connect_bd_net [get_bd_pins axi_gpio_16/gpio_io_o] [get_bd_pins low_pass_0/reset]
connect_bd_net [get_bd_pins axi_gpio_17/gpio_io_o] [get_bd_pins low_pass_1/inverse_RC_a] [get_bd_pins low_pass_1/inverse_RC_b]
connect_bd_net [get_bd_pins axi_gpio_18/gpio_io_o] [get_bd_pins low_pass_1/exp_a] [get_bd_pins low_pass_1/exp_b]
connect_bd_net [get_bd_pins axi_gpio_19/gpio_io_o] [get_bd_pins low_pass_1/reset]
connect_bd_net [get_bd_pins axi_gpio_1/gpio_io_o] [get_bd_pins Selector_1/one_two_three]
connect_bd_net [get_bd_pins axi_gpio_20/gpio_io_o] [get_bd_pins Selector_2_0/one_two]
connect_bd_net [get_bd_pins axi_gpio_21/gpio_io_o] [get_bd_pins Selector_2_1/one_two]
connect_bd_net [get_bd_pins axi_gpio_22/gpio_io_o] [get_bd_pins PID_F2_0/start_point]
connect_bd_net [get_bd_pins axi_gpio_24/gpio_io_o] [get_bd_pins PID_F2_0/count_div_limit]
connect_bd_net [get_bd_pins axi_gpio_25/gpio_io_o] [get_bd_pins low_pass_2/inverse_RC_a] [get_bd_pins low_pass_2/inverse_RC_b]
connect_bd_net [get_bd_pins axi_gpio_26/gpio_io_o] [get_bd_pins low_pass_2/exp_a] [get_bd_pins low_pass_2/exp_b]
connect_bd_net [get_bd_pins axi_gpio_27/gpio_io_o] [get_bd_pins low_pass_2/reset]
connect_bd_net [get_bd_pins axi_gpio_28/gpio_io_o] [get_bd_pins Selector_2_2/one_two]
connect_bd_net [get_bd_pins axi_gpio_29/gpio_io_o] [get_bd_pins PID_F2_0/bit_shift_kd_up]
connect_bd_net [get_bd_pins axi_gpio_2/gpio_io_o] [get_bd_pins PID_F2_0/set_kp_i]
connect_bd_net [get_bd_pins axi_gpio_30/gpio_io_o] [get_bd_pins Clock_trigger_0/rising_bit_limit]
connect_bd_net [get_bd_pins axi_gpio_31/gpio_io_o] [get_bd_pins Clock_trigger_0/rising_bitshift]
connect_bd_net [get_bd_pins axi_gpio_3/gpio_io_o] [get_bd_pins PID_F2_0/set_ki_i]
connect_bd_net [get_bd_pins axi_gpio_4/gpio_io_o] [get_bd_pins Trigger_0/Voltage_Limit]
connect_bd_net [get_bd_pins axi_gpio_5/gpio_io_o] [get_bd_pins PID_F2_0/set_kd_i]
connect_bd_net [get_bd_pins axi_gpio_6/gpio_io_o] [get_bd_pins PID_F2_0/int_rst_i]
connect_bd_net [get_bd_pins axi_gpio_7/gpio_io_o] [get_bd_pins scale_0/conf]
connect_bd_net [get_bd_pins axi_gpio_8/gpio_io_o] [get_bd_pins PID_F2_0/rstn]
connect_bd_net [get_bd_pins axi_gpio_9/gpio_io_o] [get_bd_pins PID_F2_0/bit_shift_kp]
connect_bd_net [get_bd_pins axis_red_pitaya_adc_0/adc_clk] \
  [get_bd_pins axis_red_pitaya_dac_0/aclk] [get_bd_pins clk_wiz_0/clk_in1] [get_bd_pins scale_0/clk] \
  [get_bd_pins Selector_1/clk] [get_bd_pins Selector_2_0/clk] [get_bd_pins Selector_2_1/clk] [get_bd_pins low_pass_0/clk] \
  [get_bd_pins low_pass_1/clk] [get_bd_pins low_pass_2/clk] [get_bd_pins Selector_2_2/clk] [get_bd_pins Clock_trigger_0/clk] \
  [get_bd_pins Trigger_0/clk] [get_bd_pins PID_F2_0/clk]
connect_bd_net [get_bd_pins axis_red_pitaya_adc_0/adc_csn] [get_bd_ports adc_csn_o]
connect_bd_net [get_bd_pins axis_red_pitaya_dac_0/dac_clk] [get_bd_ports dac_clk_o]
connect_bd_net [get_bd_pins axis_red_pitaya_dac_0/dac_dat] [get_bd_ports dac_dat_o]
connect_bd_net [get_bd_pins axis_red_pitaya_dac_0/dac_rst] [get_bd_ports dac_rst_o]
connect_bd_net [get_bd_pins axis_red_pitaya_dac_0/dac_sel] [get_bd_ports dac_sel_o]
connect_bd_net [get_bd_pins axis_red_pitaya_dac_0/dac_wrt] [get_bd_ports dac_wrt_o]
connect_bd_net [get_bd_pins clk_wiz_0/clk_out1] [get_bd_pins axis_red_pitaya_dac_0/ddr_clk]
connect_bd_net [get_bd_pins clk_wiz_0/locked] [get_bd_pins axis_red_pitaya_dac_0/locked]
connect_bd_net [get_bd_ports daisy_n_i] [get_bd_pins util_ds_buf_1/IBUF_DS_N]
connect_bd_net [get_bd_ports daisy_p_i] [get_bd_pins util_ds_buf_1/IBUF_DS_P]
connect_bd_net [get_bd_pins processing_system7_0/FCLK_CLK0] \
  [get_bd_pins processing_system7_0/M_AXI_GP0_ACLK] [get_bd_pins axi_gpio_0/s_axi_aclk] [get_bd_pins axi_gpio_1/s_axi_aclk] \
  [get_bd_pins axi_gpio_2/s_axi_aclk] [get_bd_pins axi_gpio_3/s_axi_aclk] [get_bd_pins axi_gpio_4/s_axi_aclk] \
  [get_bd_pins axi_gpio_5/s_axi_aclk] [get_bd_pins axi_gpio_6/s_axi_aclk] [get_bd_pins axi_gpio_7/s_axi_aclk] \
  [get_bd_pins axi_gpio_8/s_axi_aclk] [get_bd_pins axi_gpio_9/s_axi_aclk] [get_bd_pins axi_gpio_10/s_axi_aclk] \
  [get_bd_pins axi_gpio_11/s_axi_aclk] [get_bd_pins rst_ps7_0_50M/slowest_sync_clk] [get_bd_pins axi_gpio_12/s_axi_aclk] \
  [get_bd_pins axi_gpio_13/s_axi_aclk] [get_bd_pins axi_gpio_14/s_axi_aclk] [get_bd_pins axi_gpio_15/s_axi_aclk] \
  [get_bd_pins axi_gpio_16/s_axi_aclk] [get_bd_pins axi_gpio_17/s_axi_aclk] [get_bd_pins axi_gpio_18/s_axi_aclk] \
  [get_bd_pins axi_gpio_19/s_axi_aclk] [get_bd_pins axi_gpio_20/s_axi_aclk] [get_bd_pins axi_gpio_21/s_axi_aclk] \
  [get_bd_pins axi_gpio_22/s_axi_aclk] [get_bd_pins axi_gpio_23/s_axi_aclk] [get_bd_pins axi_gpio_24/s_axi_aclk] \
  [get_bd_pins axi_gpio_25/s_axi_aclk] [get_bd_pins axi_gpio_26/s_axi_aclk] [get_bd_pins axi_gpio_27/s_axi_aclk] \
  [get_bd_pins axi_gpio_28/s_axi_aclk] [get_bd_pins axi_gpio_29/s_axi_aclk] [get_bd_pins axi_gpio_30/s_axi_aclk] \
  [get_bd_pins axi_gpio_31/s_axi_aclk] [get_bd_pins ps7_0_axi_periph/ACLK] [get_bd_pins ps7_0_axi_periph/S00_ACLK] \
  [get_bd_pins ps7_0_axi_periph/M00_ACLK] [get_bd_pins ps7_0_axi_periph/M01_ACLK] [get_bd_pins ps7_0_axi_periph/M02_ACLK] \
  [get_bd_pins ps7_0_axi_periph/M03_ACLK] [get_bd_pins ps7_0_axi_periph/M04_ACLK] [get_bd_pins ps7_0_axi_periph/M05_ACLK] \
  [get_bd_pins ps7_0_axi_periph/M06_ACLK] [get_bd_pins ps7_0_axi_periph/M07_ACLK] [get_bd_pins ps7_0_axi_periph/M08_ACLK] \
  [get_bd_pins ps7_0_axi_periph/M09_ACLK] [get_bd_pins ps7_0_axi_periph/M10_ACLK] [get_bd_pins ps7_0_axi_periph/M11_ACLK] \
  [get_bd_pins ps7_0_axi_periph/M12_ACLK] [get_bd_pins ps7_0_axi_periph/M13_ACLK] [get_bd_pins ps7_0_axi_periph/M14_ACLK] \
  [get_bd_pins ps7_0_axi_periph/M15_ACLK] [get_bd_pins ps7_0_axi_periph/M16_ACLK] [get_bd_pins ps7_0_axi_periph/M17_ACLK] \
  [get_bd_pins ps7_0_axi_periph/M18_ACLK] [get_bd_pins ps7_0_axi_periph/M19_ACLK] [get_bd_pins ps7_0_axi_periph/M20_ACLK] \
  [get_bd_pins ps7_0_axi_periph/M21_ACLK] [get_bd_pins ps7_0_axi_periph/M22_ACLK] [get_bd_pins ps7_0_axi_periph/M23_ACLK] \
  [get_bd_pins ps7_0_axi_periph/M24_ACLK] [get_bd_pins ps7_0_axi_periph/M25_ACLK] [get_bd_pins ps7_0_axi_periph/M26_ACLK] \
  [get_bd_pins ps7_0_axi_periph/M27_ACLK] [get_bd_pins ps7_0_axi_periph/M28_ACLK] [get_bd_pins ps7_0_axi_periph/M29_ACLK] \
  [get_bd_pins ps7_0_axi_periph/M30_ACLK] [get_bd_pins ps7_0_axi_periph/M31_ACLK]
connect_bd_net [get_bd_pins processing_system7_0/FCLK_RESET0_N] [get_bd_pins rst_ps7_0_50M/ext_reset_in]
connect_bd_net [get_bd_pins rst_ps7_0_50M/peripheral_aresetn] \
  [get_bd_pins axi_gpio_0/s_axi_aresetn] [get_bd_pins axi_gpio_1/s_axi_aresetn] [get_bd_pins axi_gpio_2/s_axi_aresetn] \
  [get_bd_pins axi_gpio_3/s_axi_aresetn] [get_bd_pins axi_gpio_4/s_axi_aresetn] [get_bd_pins axi_gpio_5/s_axi_aresetn] \
  [get_bd_pins axi_gpio_6/s_axi_aresetn] [get_bd_pins axi_gpio_7/s_axi_aresetn] [get_bd_pins axi_gpio_8/s_axi_aresetn] \
  [get_bd_pins axi_gpio_9/s_axi_aresetn] [get_bd_pins axi_gpio_10/s_axi_aresetn] [get_bd_pins axi_gpio_11/s_axi_aresetn] \
  [get_bd_pins axi_gpio_12/s_axi_aresetn] [get_bd_pins axi_gpio_13/s_axi_aresetn] [get_bd_pins axi_gpio_14/s_axi_aresetn] \
  [get_bd_pins axi_gpio_15/s_axi_aresetn] [get_bd_pins axi_gpio_16/s_axi_aresetn] [get_bd_pins axi_gpio_17/s_axi_aresetn] \
  [get_bd_pins axi_gpio_18/s_axi_aresetn] [get_bd_pins axi_gpio_19/s_axi_aresetn] [get_bd_pins axi_gpio_20/s_axi_aresetn] \
  [get_bd_pins axi_gpio_21/s_axi_aresetn] [get_bd_pins axi_gpio_22/s_axi_aresetn] [get_bd_pins axi_gpio_23/s_axi_aresetn] \
  [get_bd_pins axi_gpio_24/s_axi_aresetn] [get_bd_pins axi_gpio_25/s_axi_aresetn] [get_bd_pins axi_gpio_26/s_axi_aresetn] \
  [get_bd_pins axi_gpio_27/s_axi_aresetn] [get_bd_pins axi_gpio_28/s_axi_aresetn] [get_bd_pins axi_gpio_29/s_axi_aresetn] \
  [get_bd_pins axi_gpio_30/s_axi_aresetn] [get_bd_pins axi_gpio_31/s_axi_aresetn] [get_bd_pins ps7_0_axi_periph/S00_ARESETN] \
  [get_bd_pins ps7_0_axi_periph/M00_ARESETN] [get_bd_pins ps7_0_axi_periph/ARESETN] \
  [get_bd_pins ps7_0_axi_periph/M01_ARESETN] [get_bd_pins ps7_0_axi_periph/M02_ARESETN] \
  [get_bd_pins ps7_0_axi_periph/M03_ARESETN] [get_bd_pins ps7_0_axi_periph/M04_ARESETN] \
  [get_bd_pins ps7_0_axi_periph/M05_ARESETN] [get_bd_pins ps7_0_axi_periph/M06_ARESETN] \
  [get_bd_pins ps7_0_axi_periph/M07_ARESETN] [get_bd_pins ps7_0_axi_periph/M08_ARESETN] \
  [get_bd_pins ps7_0_axi_periph/M09_ARESETN] [get_bd_pins ps7_0_axi_periph/M10_ARESETN] \
  [get_bd_pins ps7_0_axi_periph/M11_ARESETN] [get_bd_pins ps7_0_axi_periph/M12_ARESETN] \
  [get_bd_pins ps7_0_axi_periph/M13_ARESETN] [get_bd_pins ps7_0_axi_periph/M14_ARESETN] \
  [get_bd_pins ps7_0_axi_periph/M15_ARESETN] [get_bd_pins ps7_0_axi_periph/M16_ARESETN] \
  [get_bd_pins ps7_0_axi_periph/M17_ARESETN] [get_bd_pins ps7_0_axi_periph/M18_ARESETN] \
  [get_bd_pins ps7_0_axi_periph/M19_ARESETN] [get_bd_pins ps7_0_axi_periph/M20_ARESETN] \
  [get_bd_pins ps7_0_axi_periph/M21_ARESETN] [get_bd_pins ps7_0_axi_periph/M22_ARESETN] \
  [get_bd_pins ps7_0_axi_periph/M23_ARESETN] [get_bd_pins ps7_0_axi_periph/M24_ARESETN] \
  [get_bd_pins ps7_0_axi_periph/M25_ARESETN] [get_bd_pins ps7_0_axi_periph/M26_ARESETN] \
  [get_bd_pins ps7_0_axi_periph/M27_ARESETN] [get_bd_pins ps7_0_axi_periph/M28_ARESETN] \
  [get_bd_pins ps7_0_axi_periph/M29_ARESETN] [get_bd_pins ps7_0_axi_periph/M30_ARESETN] \
  [get_bd_pins ps7_0_axi_periph/M31_ARESETN]
connect_bd_net [get_bd_pins util_ds_buf_1/IBUF_OUT] [get_bd_pins util_ds_buf_2/OBUF_IN]
connect_bd_net [get_bd_pins util_ds_buf_2/OBUF_DS_N] [get_bd_ports daisy_n_o]
connect_bd_net [get_bd_pins util_ds_buf_2/OBUF_DS_P] [get_bd_ports daisy_p_o]

# ---- address map ----
assign_bd_address -offset 0x41200000 -range 64K -target_address_space [get_bd_addr_spaces processing_system7_0/Data] [get_bd_addr_segs axi_gpio_0/S_AXI/Reg]
assign_bd_address -offset 0x41210000 -range 64K -target_address_space [get_bd_addr_spaces processing_system7_0/Data] [get_bd_addr_segs axi_gpio_1/S_AXI/Reg]
assign_bd_address -offset 0x41220000 -range 64K -target_address_space [get_bd_addr_spaces processing_system7_0/Data] [get_bd_addr_segs axi_gpio_2/S_AXI/Reg]
assign_bd_address -offset 0x41230000 -range 64K -target_address_space [get_bd_addr_spaces processing_system7_0/Data] [get_bd_addr_segs axi_gpio_3/S_AXI/Reg]
assign_bd_address -offset 0x41240000 -range 64K -target_address_space [get_bd_addr_spaces processing_system7_0/Data] [get_bd_addr_segs axi_gpio_4/S_AXI/Reg]
assign_bd_address -offset 0x41250000 -range 64K -target_address_space [get_bd_addr_spaces processing_system7_0/Data] [get_bd_addr_segs axi_gpio_5/S_AXI/Reg]
assign_bd_address -offset 0x41260000 -range 64K -target_address_space [get_bd_addr_spaces processing_system7_0/Data] [get_bd_addr_segs axi_gpio_6/S_AXI/Reg]
assign_bd_address -offset 0x41270000 -range 64K -target_address_space [get_bd_addr_spaces processing_system7_0/Data] [get_bd_addr_segs axi_gpio_7/S_AXI/Reg]
assign_bd_address -offset 0x41280000 -range 64K -target_address_space [get_bd_addr_spaces processing_system7_0/Data] [get_bd_addr_segs axi_gpio_8/S_AXI/Reg]
assign_bd_address -offset 0x41290000 -range 64K -target_address_space [get_bd_addr_spaces processing_system7_0/Data] [get_bd_addr_segs axi_gpio_9/S_AXI/Reg]
assign_bd_address -offset 0x412A0000 -range 64K -target_address_space [get_bd_addr_spaces processing_system7_0/Data] [get_bd_addr_segs axi_gpio_10/S_AXI/Reg]
assign_bd_address -offset 0x412B0000 -range 64K -target_address_space [get_bd_addr_spaces processing_system7_0/Data] [get_bd_addr_segs axi_gpio_11/S_AXI/Reg]
assign_bd_address -offset 0x412C0000 -range 64K -target_address_space [get_bd_addr_spaces processing_system7_0/Data] [get_bd_addr_segs axi_gpio_12/S_AXI/Reg]
assign_bd_address -offset 0x412D0000 -range 64K -target_address_space [get_bd_addr_spaces processing_system7_0/Data] [get_bd_addr_segs axi_gpio_13/S_AXI/Reg]
assign_bd_address -offset 0x412E0000 -range 64K -target_address_space [get_bd_addr_spaces processing_system7_0/Data] [get_bd_addr_segs axi_gpio_14/S_AXI/Reg]
assign_bd_address -offset 0x412F0000 -range 64K -target_address_space [get_bd_addr_spaces processing_system7_0/Data] [get_bd_addr_segs axi_gpio_15/S_AXI/Reg]
assign_bd_address -offset 0x41300000 -range 64K -target_address_space [get_bd_addr_spaces processing_system7_0/Data] [get_bd_addr_segs axi_gpio_16/S_AXI/Reg]
assign_bd_address -offset 0x41310000 -range 64K -target_address_space [get_bd_addr_spaces processing_system7_0/Data] [get_bd_addr_segs axi_gpio_17/S_AXI/Reg]
assign_bd_address -offset 0x41320000 -range 64K -target_address_space [get_bd_addr_spaces processing_system7_0/Data] [get_bd_addr_segs axi_gpio_18/S_AXI/Reg]
assign_bd_address -offset 0x41330000 -range 64K -target_address_space [get_bd_addr_spaces processing_system7_0/Data] [get_bd_addr_segs axi_gpio_19/S_AXI/Reg]
assign_bd_address -offset 0x41340000 -range 64K -target_address_space [get_bd_addr_spaces processing_system7_0/Data] [get_bd_addr_segs axi_gpio_20/S_AXI/Reg]
assign_bd_address -offset 0x41350000 -range 64K -target_address_space [get_bd_addr_spaces processing_system7_0/Data] [get_bd_addr_segs axi_gpio_21/S_AXI/Reg]
assign_bd_address -offset 0x41360000 -range 64K -target_address_space [get_bd_addr_spaces processing_system7_0/Data] [get_bd_addr_segs axi_gpio_22/S_AXI/Reg]
assign_bd_address -offset 0x41370000 -range 64K -target_address_space [get_bd_addr_spaces processing_system7_0/Data] [get_bd_addr_segs axi_gpio_23/S_AXI/Reg]
assign_bd_address -offset 0x41380000 -range 64K -target_address_space [get_bd_addr_spaces processing_system7_0/Data] [get_bd_addr_segs axi_gpio_24/S_AXI/Reg]
assign_bd_address -offset 0x41390000 -range 64K -target_address_space [get_bd_addr_spaces processing_system7_0/Data] [get_bd_addr_segs axi_gpio_25/S_AXI/Reg]
assign_bd_address -offset 0x413A0000 -range 64K -target_address_space [get_bd_addr_spaces processing_system7_0/Data] [get_bd_addr_segs axi_gpio_26/S_AXI/Reg]
assign_bd_address -offset 0x413B0000 -range 64K -target_address_space [get_bd_addr_spaces processing_system7_0/Data] [get_bd_addr_segs axi_gpio_27/S_AXI/Reg]
assign_bd_address -offset 0x413C0000 -range 64K -target_address_space [get_bd_addr_spaces processing_system7_0/Data] [get_bd_addr_segs axi_gpio_28/S_AXI/Reg]
assign_bd_address -offset 0x413D0000 -range 64K -target_address_space [get_bd_addr_spaces processing_system7_0/Data] [get_bd_addr_segs axi_gpio_29/S_AXI/Reg]
assign_bd_address -offset 0x413E0000 -range 64K -target_address_space [get_bd_addr_spaces processing_system7_0/Data] [get_bd_addr_segs axi_gpio_30/S_AXI/Reg]
assign_bd_address -offset 0x413F0000 -range 64K -target_address_space [get_bd_addr_spaces processing_system7_0/Data] [get_bd_addr_segs axi_gpio_31/S_AXI/Reg]

validate_bd_design
save_bd_design
